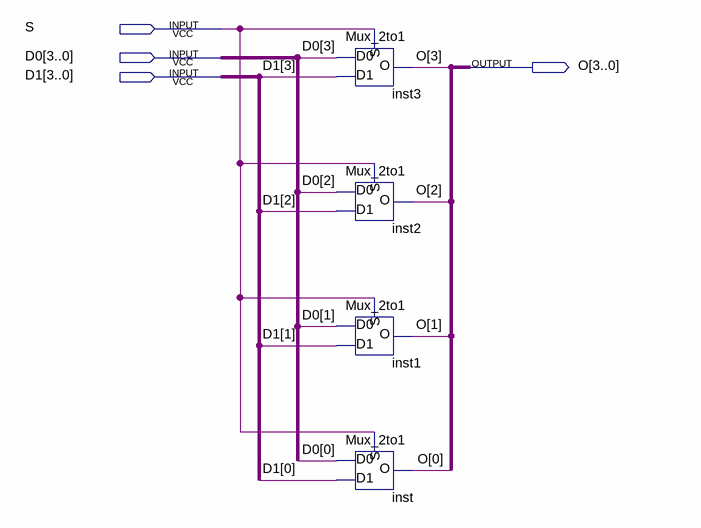
[diagram p0: schematic sheet]
// Quartus schematic Mux4_2to1.bdf as structural Verilog: 4 symbols, 4 pins
module Mux4_2to1 (
  input  S,
  input  [3:0] D0,
  input  [3:0] D1,
  output [3:0] O
);

  Mux_2to1 inst3 (.S(S), .D0(D0[3]), .D1(D1[3]), .O(O[3]));
  Mux_2to1 inst2 (.S(S), .D0(D0[2]), .D1(D1[2]), .O(O[2]));
  Mux_2to1 inst1 (.S(S), .D0(D0[1]), .D1(D1[1]), .O(O[1]));
  Mux_2to1 inst (.S(S), .D0(D0[0]), .D1(D1[0]), .O(O[0]));
endmodule
